# EAGLE board SPU_Rev_2.0 (EAGLE 9.6.2)
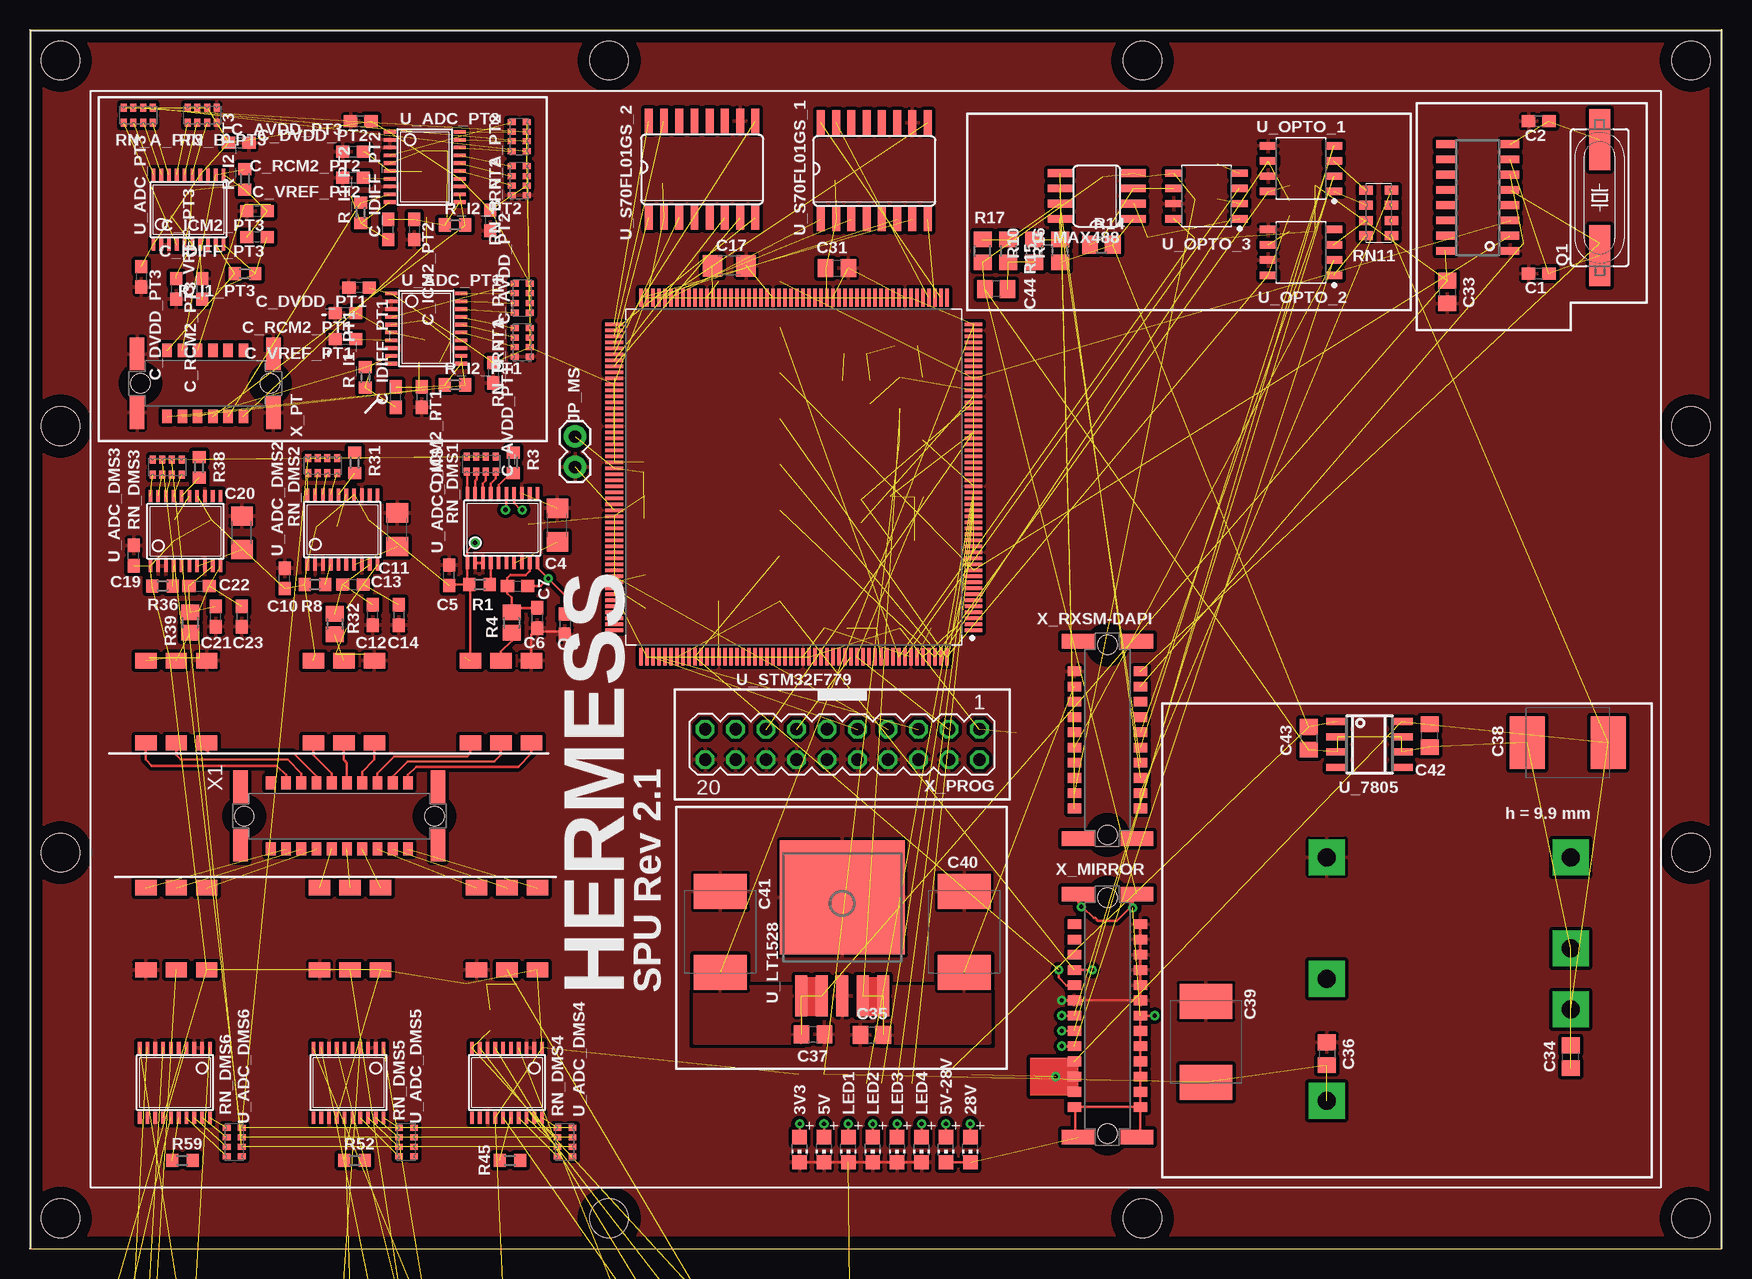
[diagram p9: board, top side]
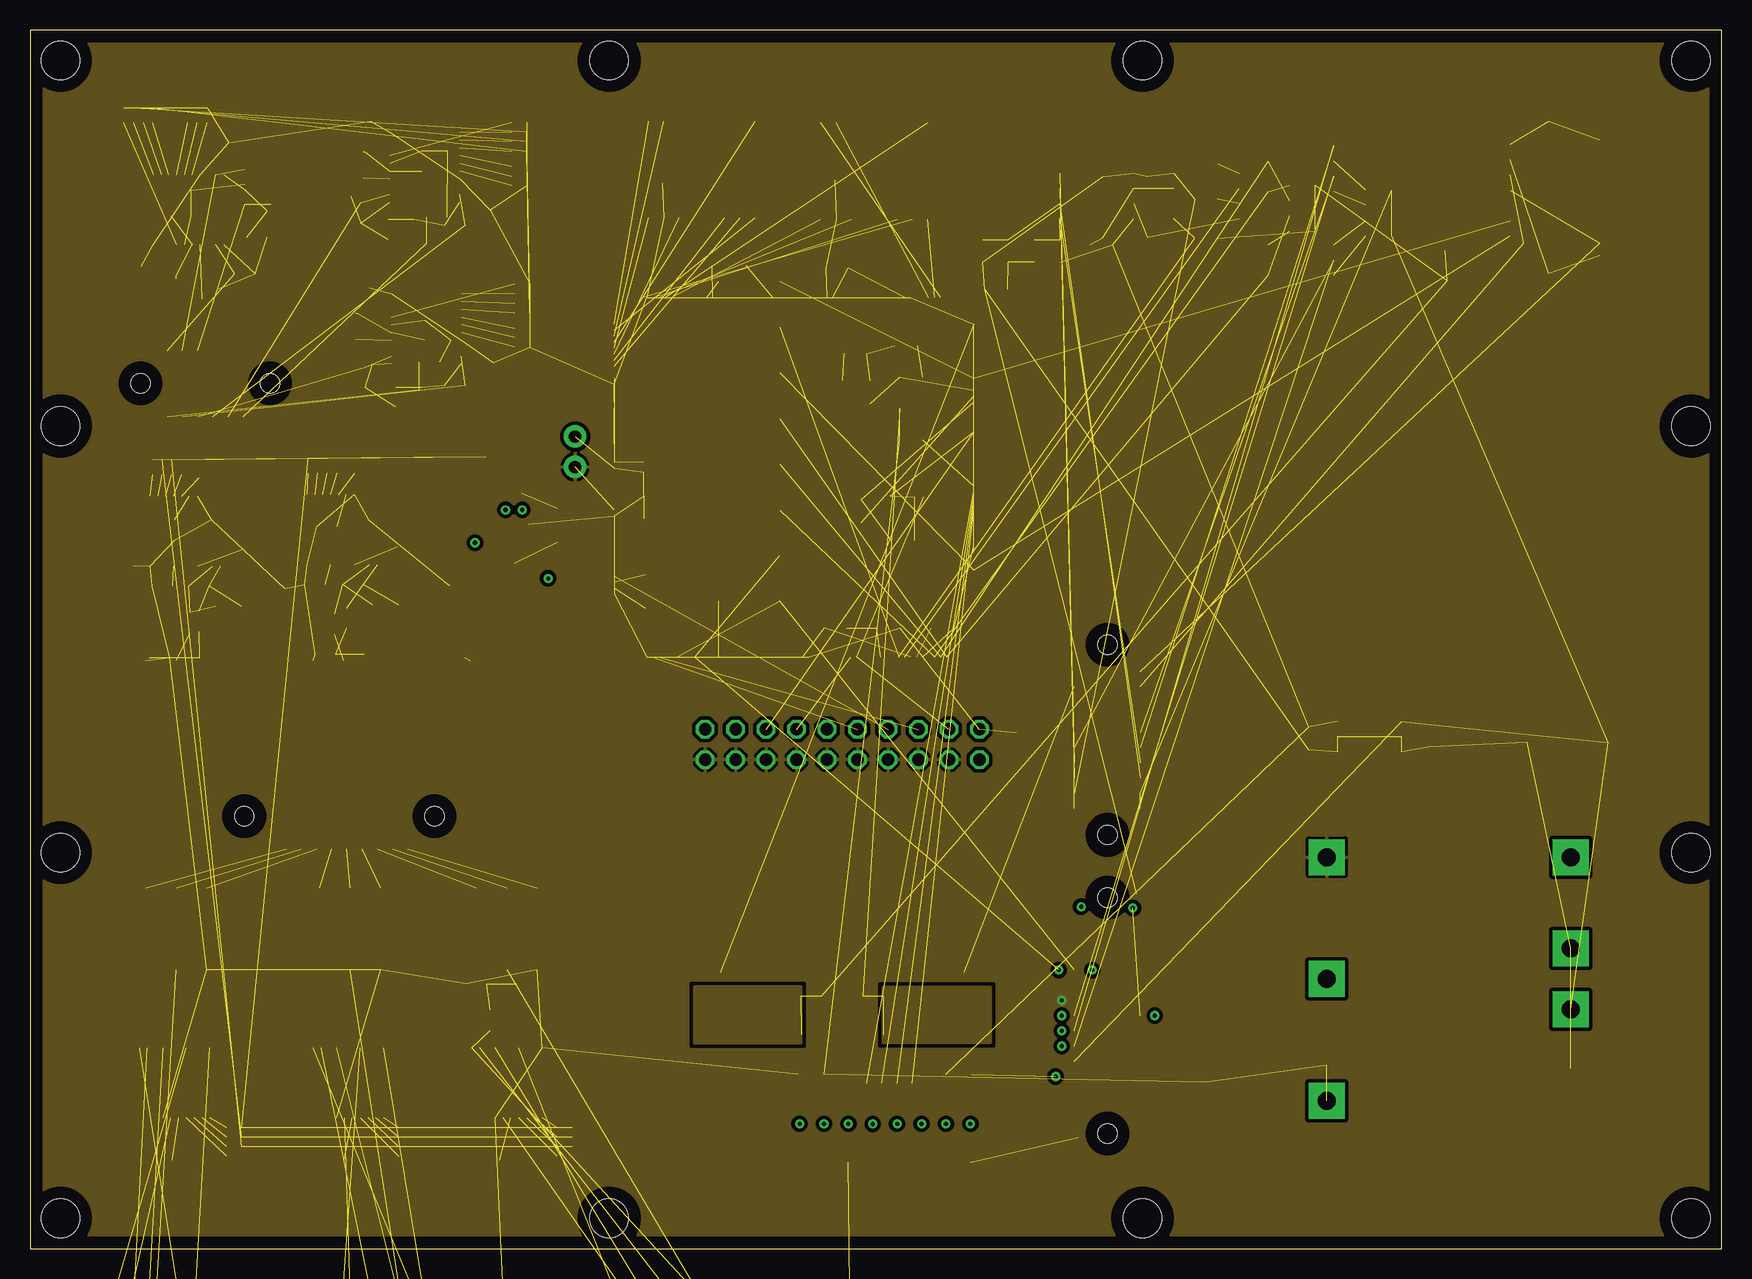
[diagram p10: board, inner layer Route2]
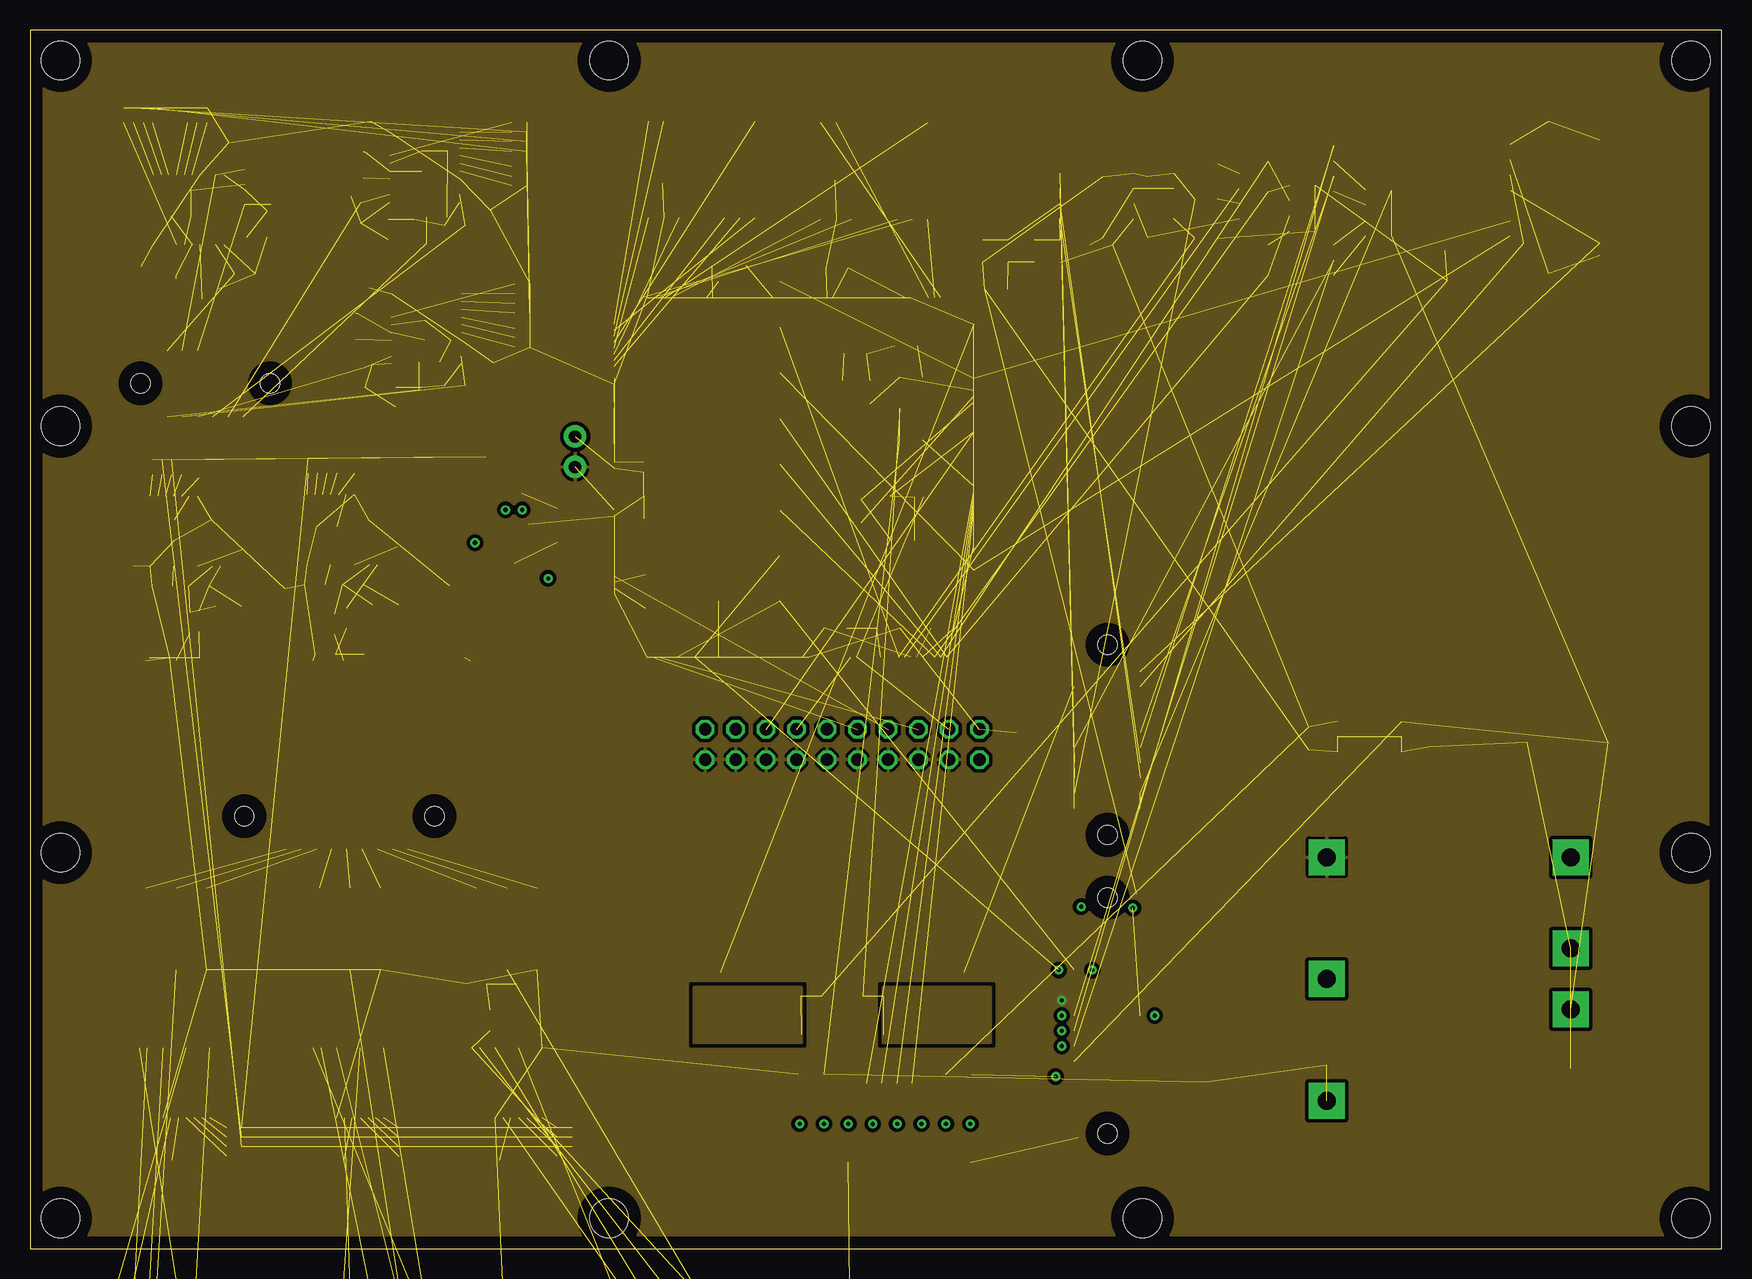
[diagram p11: board, inner layer Route15]
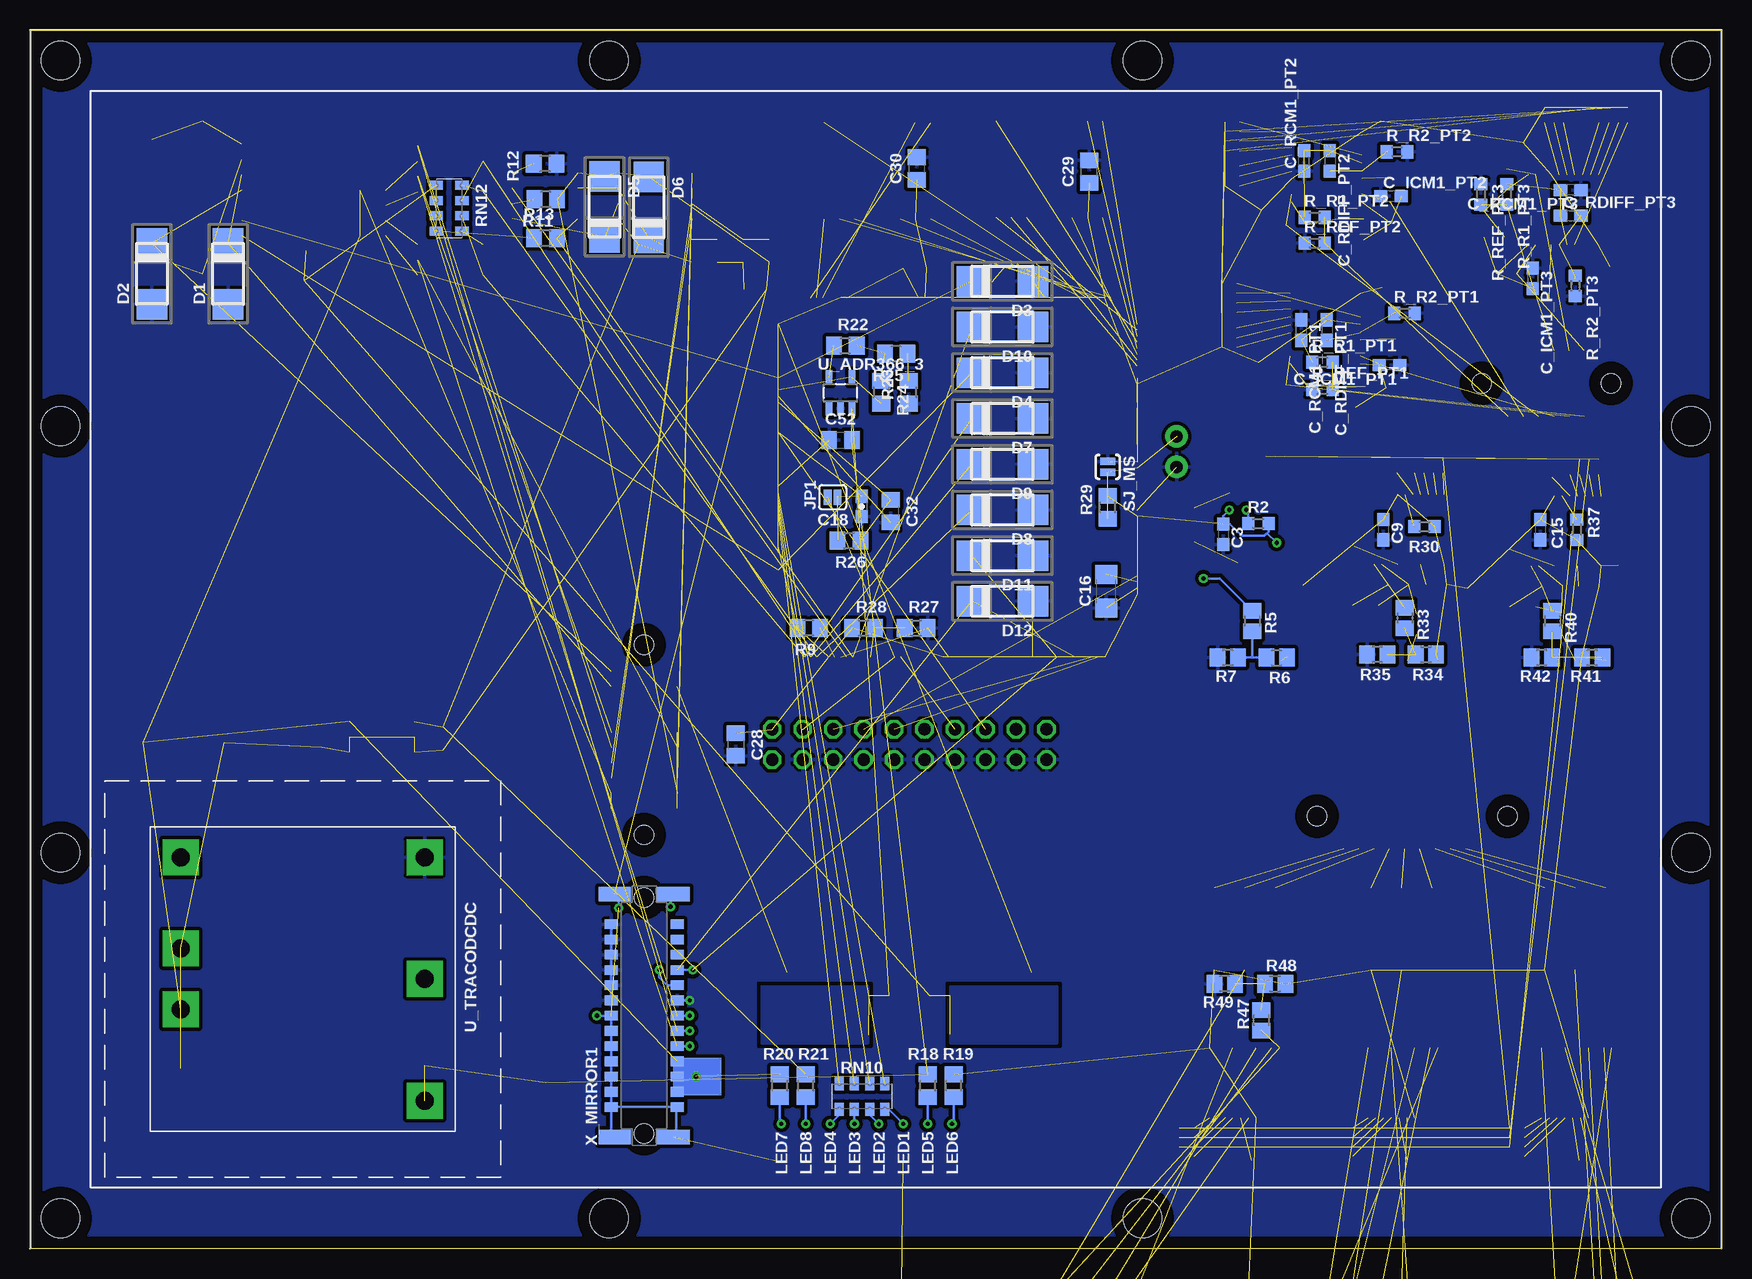
[diagram p12: board, bottom side, seen from below]

Size 140.97 x 101.6 mm. Coordinates in mm from the lower left corner, seen from the top.
Outline: 0,0 140.97,0 140.97,101.6 0,101.6 0,0
Copper layers (1+2+15+16): Top 0.035mm / dielectric 0.2mm / Route2 0.017mm / dielectric 0.2mm / Route15 0.017mm / dielectric 0.2mm / Bottom 0.035mm
Design rules "default *": minimum track width 8mil, minimum drill 0.35mm, track to track 9mil, track to pad 8mil, pad to pad 8mil, via to via 12mil, smd to smd 6mil, copper to edge 40mil, drill to drill 6mil, minimum pad ring 10mil, minimum via ring 8mil, stop-mask expansion 4mil, vias tented up to drill 0mil, thermal gap 10mil
Holes 3.2 mm at 2.54,99.06 2.54,2.54 138.43,2.54 138.43,99.06 48.26,99.06 92.71,99.06 48.26,2.54 92.71,2.54 2.54,68.58 2.54,33.02 138.43,33.02 138.43,68.58
tKeepout: area 0,0 to 141,101.6

## Footprints (pad centres in the part's own frame; a part is rotated, then mirrored left to right if it is on the bottom)
C0603 = smd 1.1 x 1: 1 -0.85,0; 2 0.85,0
C1206 = smd 1.6 x 1.8: 1 -1.4,0; 2 1.4,0
0603-CAP = smd 1.1 x 1: 1 -0.85,0; 2 0.85,0
C0805 = smd 1.3 x 1.5: 1 -0.95,0; 2 0.95,0
E/7260-38W = smd 2.95 x 4.4: + 3.375,0; - -3.375,0
DMELF = smd 2.54 x 2.54: A -2.54,0; C 2.54,0
SMT-JUMPER_2_NC_PASTE_SILK = smd 0.635 x 1.27: 1 -0.406,0; 2 0.406,0
1X02 = drill 1.016 pad 1.88: 1 0,0; 2 2.54,0
CHIP-LED0805 = smd 1.2 x 1.2: A 0,-1.05; C 0,1.05
SM49 = smd 5.08 x 1.778: 1 -4.826,0; 2 4.826,0
R0603 = smd 1 x 1.1: 1 -0.85,0; 2 0.85,0
R0805 = smd 1.3 x 1.5: 1 -0.85,0; 2 0.85,0
R0805' = smd 1.3 x 1.5: 1 -0.95,0; 2 0.95,0
EXBS8V = smd 0.75 x 1.1: 1 -1.905,-1.07; 2 -0.635,-1.07; 3 0.635,-1.07; 4 1.905,-1.07; 5 1.905,1.07; 6 0.635,1.07; 7 -0.635,1.07; 8 -1.905,1.07
0603-ARC = smd 0.5 x 0.65: 1 -1.2,-0.625; 2 -0.4,-0.625; 3 0.4,-0.625; 4 1.2,-0.625; 5 1.2,0.625; 6 0.4,0.625; 7 -0.4,0.625; 8 -1.2,0.625
SJ_2S-NO = smd 0.635 x 1.27: 1 -0.45,0; 2 0.45,0
COMMON_MODE_CHOKE = smd 1.27 x 1.78: P$1 0,5.08; P$2 6.86,5.08; P$3 0,2.54; P$4 6.86,2.54; P$5 0,0; P$6 6.86,0
SOIC8 = smd 0.6 x 1.8: 1 -1.905,-2.7; 2 -0.635,-2.7; 3 0.635,-2.7; 4 1.905,-2.7; 5 1.905,2.7; 6 0.635,2.7; 7 -0.635,2.7; 8 -1.905,2.7
TSSOP20 = smd 0.305 x 0.991: 1 -2.925,-2.918; 2 -2.275,-2.918; 3 -1.625,-2.918; 4 -0.975,-2.918; 5 -0.325,-2.918; 6 0.325,-2.918; 7 0.975,-2.918; 8 1.625,-2.918; 9 2.275,-2.918; 10 2.925,-2.918; 11 2.925,2.918; 12 2.275,2.918; 13 1.625,2.918; 14 0.975,2.918; 15 0.325,2.918; 16 -0.325,2.918; 17 -0.975,2.918; 18 -1.625,2.918; 19 -2.275,2.918; 20 -2.925,2.918
SOT23-5 = smd 0.55 x 1.2: 1 -0.95,-1.3; 2 0,-1.3; 3 0.95,-1.3; 4 0.95,1.3; 5 -0.95,1.3
SOIC16 = smd 0.635 x 1.524: 1 -4.445,-2.695; 2 -3.175,-2.695; 3 -1.905,-2.695; 4 -0.635,-2.695; 5 0.635,-2.695; 6 1.905,-2.695; 7 3.175,-2.695; 8 4.445,-2.695; 9 4.445,2.695; 10 3.175,2.695; 11 1.905,2.695; 12 0.635,2.695; 13 -0.635,2.695; 14 -1.905,2.695; 15 -3.175,2.695; 16 -4.445,2.695
Q5-DD = smd 1 x 3.4: 1 -3.4,-7.875; 2 -1.7,-7.875; 3 0,-7.875; 4 1.7,-7.875; 5 3.4,-7.875 | smd 10.414 x 9.525: 6 0,0.325
SO08 = smd 0.66 x 2.032: 1 -1.905,-3.073; 2 -0.635,-3.073; 3 0.635,-3.073; 4 1.905,-3.073; 5 1.905,3.073; 6 0.635,3.073; 7 -0.635,3.073; 8 -1.905,3.073
SOIC127P594X363-8N = smd 1.44 x 0.614: 1 -2.731,1.905; 2 -2.731,0.635; 3 -2.731,-0.635; 4 -2.731,-1.905; 5 2.731,-1.905; 6 2.731,-0.635; 7 2.731,0.635; 8 2.731,1.905
SO16 = smd 0.66 x 2.032: 1 -4.445,-3.073; 2 -3.175,-3.073; 3 -1.905,-3.073; 4 -0.635,-3.073; 5 0.635,-3.073; 6 1.905,-3.073; 7 3.175,-3.073; 8 4.445,-3.073; 9 4.445,4.978; 10 3.175,4.978; 11 1.905,4.978; 12 0.635,4.978; 13 -0.635,4.978; 14 -1.905,4.978; 15 -3.175,4.978; 16 -4.445,4.978
QFP50P3060X3060X385-208 = smd 1.469 x 0.28: 1 -14.971,12.75; 2 -14.971,12.25; 3 -14.971,11.75; 4 -14.971,11.25; 5 -14.971,10.75; 6 -14.971,10.25; 7 -14.971,9.75; 8 -14.971,9.25; 9 -14.971,8.75; 10 -14.971,8.25; 11 -14.971,7.75; 12 -14.971,7.25; 13 -14.971,6.75; 14 -14.971,6.25; 15 -14.971,5.75; 16 -14.971,5.25; 17 -14.971,4.75; 18 -14.971,4.25; 19 -14.971,3.75; 20 -14.971,3.25; 21 -14.971,2.75; 22 -14.971,2.25; 23 -14.971,1.75; 24 -14.971,1.25; 25 -14.971,0.75; 26 -14.971,0.25; 27 -14.971,-0.25; 28 -14.971,-0.75; 29 -14.971,-1.25; 30 -14.971,-1.75; 31 -14.971,-2.25; 32 -14.971,-2.75; 33 -14.971,-3.25; 34 -14.971,-3.75; 35 -14.971,-4.25; 36 -14.971,-4.75; 37 -14.971,-5.25; 38 -14.971,-5.75; 39 -14.971,-6.25; 40 -14.971,-6.75; 41 -14.971,-7.25; 42 -14.971,-7.75; 43 -14.971,-8.25; 44 -14.971,-8.75; 45 -14.971,-9.25; 46 -14.971,-9.75; 47 -14.971,-10.25; 48 -14.971,-10.75; 49 -14.971,-11.25; 50 -14.971,-11.75; 51 -14.971,-12.25; 52 -14.971,-12.75; 105 14.971,-12.75; 106 14.971,-12.25; 107 14.971,-11.75; 108 14.971,-11.25; 109 14.971,-10.75; 110 14.971,-10.25; 111 14.971,-9.75; 112 14.971,-9.25; 113 14.971,-8.75; 114 14.971,-8.25; 115 14.971,-7.75; 116 14.971,-7.25; 117 14.971,-6.75; 118 14.971,-6.25; 119 14.971,-5.75; 120 14.971,-5.25; 121 14.971,-4.75; 122 14.971,-4.25; 123 14.971,-3.75; 124 14.971,-3.25; 125 14.971,-2.75; 126 14.971,-2.25; 127 14.971,-1.75; 128 14.971,-1.25; 129 14.971,-0.75; 130 14.971,-0.25; 131 14.971,0.25; 132 14.971,0.75; 133 14.971,1.25; 134 14.971,1.75; 135 14.971,2.25; 136 14.971,2.75; 137 14.971,3.25; 138 14.971,3.75; 139 14.971,4.25; 140 14.971,4.75; 141 14.971,5.25; 142 14.971,5.75; 143 14.971,6.25; 144 14.971,6.75; 145 14.971,7.25; 146 14.971,7.75; 147 14.971,8.25; 148 14.971,8.75; 149 14.971,9.25; 150 14.971,9.75; 151 14.971,10.25; 152 14.971,10.75; 153 14.971,11.25; 154 14.971,11.75; 155 14.971,12.25; 156 14.971,12.75 | smd 0.28 x 1.469: 53 -12.75,-14.971; 54 -12.25,-14.971; 55 -11.75,-14.971; 56 -11.25,-14.971; 57 -10.75,-14.971; 58 -10.25,-14.971; 59 -9.75,-14.971; 60 -9.25,-14.971; 61 -8.75,-14.971; 62 -8.25,-14.971; 63 -7.75,-14.971; 64 -7.25,-14.971; 65 -6.75,-14.971; 66 -6.25,-14.971; 67 -5.75,-14.971; 68 -5.25,-14.971; 69 -4.75,-14.971; 70 -4.25,-14.971; 71 -3.75,-14.971; 72 -3.25,-14.971; 73 -2.75,-14.971; 74 -2.25,-14.971; 75 -1.75,-14.971; 76 -1.25,-14.971; 77 -0.75,-14.971; 78 -0.25,-14.971; 79 0.25,-14.971; 80 0.75,-14.971; 81 1.25,-14.971; 82 1.75,-14.971; 83 2.25,-14.971; 84 2.75,-14.971; 85 3.25,-14.971; 86 3.75,-14.971; 87 4.25,-14.971; 88 4.75,-14.971; 89 5.25,-14.971; 90 5.75,-14.971; 91 6.25,-14.971; 92 6.75,-14.971; 93 7.25,-14.971; 94 7.75,-14.971; 95 8.25,-14.971; 96 8.75,-14.971; 97 9.25,-14.971; 98 9.75,-14.971; 99 10.25,-14.971; 100 10.75,-14.971; 101 11.25,-14.971; 102 11.75,-14.971; 103 12.25,-14.971; 104 12.75,-14.971; 157 12.75,14.971; 158 12.25,14.971; 159 11.75,14.971; 160 11.25,14.971; 161 10.75,14.971; 162 10.25,14.971; 163 9.75,14.971; 164 9.25,14.971; 165 8.75,14.971; 166 8.25,14.971; 167 7.75,14.971; 168 7.25,14.971; 169 6.75,14.971; 170 6.25,14.971; 171 5.75,14.971; 172 5.25,14.971; 173 4.75,14.971; 174 4.25,14.971; 175 3.75,14.971; 176 3.25,14.971; 177 2.75,14.971; 178 2.25,14.971; 179 1.75,14.971; 180 1.25,14.971; 181 0.75,14.971; 182 0.25,14.971; 183 -0.25,14.971; 184 -0.75,14.971; 185 -1.25,14.971; 186 -1.75,14.971; 187 -2.25,14.971; 188 -2.75,14.971; 189 -3.25,14.971; 190 -3.75,14.971; 191 -4.25,14.971; 192 -4.75,14.971; 193 -5.25,14.971; 194 -5.75,14.971; 195 -6.25,14.971; 196 -6.75,14.971; 197 -7.25,14.971; 198 -7.75,14.971; 199 -8.25,14.971; 200 -8.75,14.971; 201 -9.25,14.971; 202 -9.75,14.971; 203 -10.25,14.971; 204 -10.75,14.971; 205 -11.25,14.971; 206 -11.75,14.971; 207 -12.25,14.971; 208 -12.75,14.971
THL_20WI_SERIES = drill 1.5 pad 3 square: 1 -2.54,10.16; 2 2.54,10.16; 3 -10.16,-10.16; 4 0,-10.16; 5 10.16,-10.16; 6 10.16,10.16
403-5X020-5X = smd 0.8 x 1.1: P$A1 5.715,-2.75; P$A2 4.445,-2.75; P$A3 3.175,-2.75; P$A4 1.905,-2.75; P$A5 0.635,-2.75; P$A6 -0.635,-2.75; P$A7 -1.905,-2.75; P$A8 -3.175,-2.75; P$A9 -4.445,-2.75; P$A10 -5.715,-2.75; P$B1 5.715,2.75; P$B2 4.445,2.75; P$B3 3.175,2.75; P$B4 1.905,2.75; P$B5 0.635,2.75; P$B6 -0.635,2.75; P$B7 -1.905,2.75; P$B8 -3.175,2.75; P$B9 -4.445,2.75; P$B10 -5.715,2.75 | smd 1.2 x 2.7: P$BL1 -8.225,2.45; P$BL2 8.225,2.45; P$BL3 -8.225,-2.45; P$BL4 8.225,-2.45 | hole 1.6: -7.925,0; 7.925,0
403-5X026-5X = smd 0.8 x 1.1: P$A1 7.62,-2.75; P$A2 6.35,-2.75; P$A3 5.08,-2.75; P$A4 3.81,-2.75; P$A5 2.54,-2.75; P$A6 1.27,-2.75; P$A7 0,-2.75; P$A8 -1.27,-2.75; P$A9 -2.54,-2.75; P$A10 -3.81,-2.75; P$A11 -5.08,-2.75; P$A12 -6.35,-2.75; P$A13 -7.62,-2.75; P$B1 7.62,2.75; P$B2 6.35,2.75; P$B3 5.08,2.75; P$B4 3.81,2.75; P$B5 2.54,2.75; P$B6 1.27,2.75; P$B7 0,2.75; P$B8 -1.27,2.75; P$B9 -2.54,2.75; P$B10 -3.81,2.75; P$B11 -5.08,2.75; P$B12 -6.35,2.75; P$B13 -7.62,2.75 | smd 1.2 x 2.7: P$BL1 -10.13,2.45; P$BL2 10.13,2.45; P$BL3 -10.13,-2.45; P$BL4 10.13,-2.45 | hole 1.6: -9.83,0; 9.83,0
MA10-2 = drill 1.016 octagon: 1 -11.43,-1.27; 2 -11.43,1.27; 3 -8.89,-1.27; 4 -8.89,1.27; 5 -6.35,-1.27; 6 -6.35,1.27; 7 -3.81,-1.27; 8 -3.81,1.27; 9 -1.27,-1.27; 10 -1.27,1.27; 11 1.27,-1.27; 12 1.27,1.27; 13 3.81,-1.27; 14 3.81,1.27; 15 6.35,-1.27; 16 6.35,1.27; 17 8.89,-1.27; 18 8.89,1.27; 19 11.43,-1.27; 20 11.43,1.27
403-5X012-5X = smd 0.8 x 1.1: P$A1 3.175,-2.75; P$A2 1.905,-2.75; P$A3 0.635,-2.75; P$A4 -0.635,-2.75; P$A5 -1.905,-2.75; P$A6 -3.175,-2.75; P$B1 3.175,2.75; P$B2 1.905,2.75; P$B3 0.635,2.75; P$B4 -0.635,2.75; P$B5 -1.905,2.75; P$B6 -3.175,2.75 | smd 1.2 x 2.7: P$BL1 -5.685,2.45; P$BL2 5.685,2.45; P$BL3 -5.685,-2.45; P$BL4 5.685,-2.45 | hole 1.6: -5.385,0; 5.385,0

## Placement (x,y rotation side)
C1  22p  [C0603]  125.73,81.28 180 top
C2  22p  [C0603]  125.73,93.98 180 top
C3  100n  [C0603]  41.53,59.56 270 bottom
C4  1u  [C1206]  43.94,60.33 90 top
C5  100n  [C0603]  34.93,56.13 90 top
C6  100n  [C0603]  42.29,52.58 90 top
C7  100n  [C0603]  40.64,55.24 0 top
C8  100n  [C0603]  44.58,52.07 270 top
C9  100n  [C0603]  28.19,59.94 270 bottom
C10  100n  [C0603]  21.21,55.88 90 top
C11  1u  [C1206]  30.61,59.94 90 top
C12  100n  [C0603]  28.58,52.83 90 top
C13  100n  [C0603]  26.92,55.37 0 top
C14  100n  [C0603]  30.73,52.83 270 top
C15  100n  [C0603]  15.11,59.94 270 bottom
C16  2.2u  [C1206]  51.28,54.81 90 bottom
C17  2.2u  [C1206]  58.27,81.94 180 top
C18  100n  [0603-CAP]  71.67,61.88 270 bottom
C19  100n  [C0603]  8.64,57.78 90 top
C20  1u  [C1206]  17.65,59.69 90 top
C21  100n  [C0603]  15.49,52.7 90 top
C22  100n  [C0603]  14.1,55.24 0 top
C23  100n  [C0603]  17.65,52.7 270 top
C24  100n  [C0603]  51.44,-14.35 90 top  (outside the outline)
C25  100n  [C0603]  55.25,-14.35 90 top  (outside the outline)
C26  1u  [C1206]  58.93,-15.11 90 top  (outside the outline)
C27  100n  [C0603]  62.1,-15.11 90 top  (outside the outline)
C28  100n  [C0805]  82.17,42.04 270 bottom
C29  100n  [C0805]  52.7,89.79 90 bottom
C30  100n  [C0805]  67.06,90.04 90 bottom
C31  100n  [C0805]  67.25,81.74 0 top
C32  100n  [C0805]  69.26,61.5 270 bottom
C33  100n  [C0805]  118.11,79.76 270 top
C34  100n  [C0805]  128.4,16 90 top
C35  100n  [C0805]  70.15,17.83 0 top
C36  100n  [C0805]  108.08,16.26 270 top
C37  100n  [C0805]  65.25,17.86 180 top
C38  10u  [E/7260-38W]  128.14,42.19 0 top
C39  10u  [E/7260-38W]  97.99,17.25 270 top
C40  10u  [E/7260-38W]  77.85,26.42 270 top
C41  10u  [E/7260-38W]  57.53,26.42 270 top
C42  100n  [C0805]  116.64,42.77 90 top
C43  100n  [C0805]  106.55,42.55 270 top
C44  ~0  [C0805]  80.52,80.01 180 top
C45  100n  [C0603]  65.02,-14.86 90 top  (outside the outline)
C46  100n  [C0603]  68.45,-14.61 90 top  (outside the outline)
C47  100n  [C0603]  37.08,-24.38 0 top  (outside the outline)
C48  100n  [C0603]  42.42,-24.38 0 top  (outside the outline)
C49  1u  [C1206]  34.42,-13.08 0 top  (outside the outline)
C50  100n  [C0603]  23.75,-29.72 0 top  (outside the outline)
C51  100n  [C0603]  29.08,-29.72 0 top  (outside the outline)
C52  10n  [C0805]  73.43,67.41 0 bottom
C53  100n  [C0603]  34.42,-29.72 0 top  (outside the outline)
C54  100n  [C0603]  13.46,-24.26 0 top  (outside the outline)
C55  100n  [C0603]  18.8,-24.26 0 top  (outside the outline)
C56  1u  [C1206]  10.79,-12.95 0 top  (outside the outline)
C57  100n  [C0603]  0.13,-29.59 0 top  (outside the outline)
C58  100n  [C0603]  5.46,-29.59 0 top  (outside the outline)
C59  100n  [C0603]  10.79,-29.59 0 top  (outside the outline)
C_AVDD_PT1  100n  [C0603]  38.61,73.03 270 top
C_AVDD_PT2  100n  [C0603]  38.35,85.72 270 top
C_AVDD_PT3  100n  [C0603]  17.4,92.2 0 top
C_DVDD_PT1  100n  [C0603]  27.43,80.14 180 top
C_DVDD_PT2  100n  [C0603]  27.56,93.98 180 top
C_DVDD_PT3  100n  [C0603]  9.27,81.03 270 top
C_ICM1_PT1  [C0603]  27.69,73.66 180 bottom
C_ICM1_PT2  [C0603]  27.56,87.76 0 bottom
C_ICM1_PT3  [C0603]  15.75,80.9 270 bottom
C_ICM2_PT1  [C0603]  32.64,70.99 270 top
C_ICM2_PT2  [C0603]  32,84.96 270 top
C_ICM2_PT3  [C0603]  18.92,86.49 180 top
C_IDIFF_PT1  [C0603]  30.48,70.99 90 top
C_IDIFF_PT2  [C0603]  29.84,84.96 90 top
C_IDIFF_PT3  [C0603]  18.92,84.33 180 top
C_RCM1_PT1  [C0603]  35.05,76.58 270 bottom
C_RCM1_PT2  [C0603]  34.8,90.68 90 bottom
C_RCM1_PT3  [C0603]  12.57,88.27 180 bottom
C_RCM2_PT1  [C0603]  26.29,77.98 180 top
C_RCM2_PT2  [C0603]  26.92,91.44 180 top
C_RCM2_PT3  [C0603]  12.19,80.01 270 top
C_RDIFF_PT1  [C0603]  32.89,76.58 270 bottom
C_RDIFF_PT2  [C0603]  32.64,90.68 270 bottom
C_RDIFF_PT3  [C0603]  12.57,86.11 0 bottom
C_VREF_PT1  1u  [C0603]  26.29,75.82 180 top
C_VREF_PT2  1u  [C0603]  26.92,89.28 180 top
C_VREF_PT3  1u  [C0603]  14.35,80.01 90 top
D1  6V  [DMELF]  124.46,81.28 90 bottom
D2  6V  [DMELF]  130.81,81.28 90 bottom
D3  3V6  [DMELF]  59.94,80.64 180 bottom
D4  3V6  [DMELF]  59.94,73.03 180 bottom
D5  6V  [DMELF]  93.09,86.87 270 bottom
D6  6V  [DMELF]  89.41,86.82 270 bottom
D7  3V6  [DMELF]  59.94,69.22 180 bottom
D8  3V6  [DMELF]  59.94,61.59 180 bottom
D9  3V6  [DMELF]  59.94,65.41 180 bottom
D10  3V6  [DMELF]  59.94,76.83 180 bottom
D11  3V6  [DMELF]  59.94,57.78 180 bottom
D12  3V6  [DMELF]  59.94,53.98 180 bottom
JP1  JUMPER-SMT_2_NC_PASTE_SILK  [SMT-JUMPER_2_NC_PASTE_SILK]  74.09,62.64 180 bottom
JP_MS  [1X02]  45.42,65.17 90 top
LED1  1V9  [CHIP-LED0805]  68.2,8.26 180 top
LED2  1V9  [CHIP-LED0805]  70.23,8.26 180 top
LED3  1V9  [CHIP-LED0805]  72.26,8.26 180 top
LED4  1V9  [CHIP-LED0805]  74.3,8.26 180 top
LED5  1V9  [CHIP-LED0805]  66.17,8.26 180 top
LED6  1V9  [CHIP-LED0805]  64.14,8.26 180 top
LED7  [CHIP-LED0805]  78.36,8.26 180 top
LED8  [CHIP-LED0805]  76.33,8.26 180 top
Q1  12MHz  [SM49]  130.81,87.63 90 top
R1  4k7  [R0603]  37.47,55.37 0 top
R2  4k7  [R0603]  38.61,60.45 0 bottom
R3  47  [R0603]  40.26,65.53 90 top
R4  40 1%  [R0805]  40.13,52.2 270 top
R5  40 1%  [R0805]  39.12,52.32 270 bottom
R6  1k 0.1%  [R0805]  37.08,49.28 0 bottom
R7  1k 0.1%  [R0805]  41.15,49.28 180 bottom
R8  4k7  [R0603]  23.75,55.37 0 top
R9  10k  [R0805']  76.07,51.75 180 bottom
R10  500  [R0805']  83.69,83.19 90 top
R11  3k  [R0805']  97.99,87.48 180 bottom
R12  2k  [R0805']  98.04,90.45 180 bottom
R13  4k7  [R0805']  98.02,84.23 180 bottom
R14  7k5  [R0805']  89.28,83.69 0 top
R15  500  [R0805']  81.53,83.19 270 top
R16  3k3  [R0805']  85.85,83.19 90 top
R17  3k3  [R0805']  79.38,83.19 90 top
R18  680  [R0805']  66.17,13.59 90 bottom
R19  330  [R0805']  64.01,13.59 90 bottom
R20  4k7  [R0805']  78.49,13.59 90 bottom
R21  470  [R0805']  76.33,13.59 90 bottom
R22  100k  [R0805']  73.03,75.29 0 bottom
R23  1k  [R0805']  67.74,71.4 90 bottom
R24  ?  [R0805']  70.03,71.4 270 bottom
R25  ?  [R0805']  68.79,74.6 180 bottom
R26  10k  [R0805']  72.73,59.04 0 bottom
R27  10k  [R0805']  67.12,51.75 0 bottom
R28  99M  [R0805']  71.51,51.75 0 bottom
R29  10k  [R0805']  51.17,61.8 90 bottom
R30  4k7  [R0603]  24.77,60.2 0 bottom
R31  47  [R0603]  27.05,65.53 90 top
R32  40 1%  [R0805]  25.4,52.07 270 top
R33  40 1%  [R0805]  26.42,52.58 270 bottom
R34  1k 0.1%  [R0805]  24.64,49.53 0 bottom
R35  1k 0.1%  [R0805]  28.7,49.53 180 bottom
R36  4k7  [R0603]  11.05,55.24 0 top
R37  4k7  [R0603]  12.06,59.94 270 bottom
R38  47  [R0603]  14.1,65.15 90 top
R39  40 1%  [R0805]  13.33,52.2 270 top
R40  40 1%  [R0805]  14.1,52.32 270 bottom
R41  1k 0.1%  [R0805]  10.79,49.28 180 bottom
R42  1k 0.1%  [R0805]  14.99,49.28 180 bottom
R43  4k7  [R0603]  50.93,-9.91 90 top  (outside the outline)
R44  4k7  [R0603]  54.74,-10.16 90 top  (outside the outline)
R45  47  [R0603]  40.01,7.37 0 top
R46  40 1%  [R0805]  59.18,-10.41 90 top  (outside the outline)
R47  40 1%  [R0805]  38.35,19.05 90 bottom
R48  1k 0.1%  [R0805]  37.21,22.1 0 bottom
R49  1k 0.1%  [R0805]  41.4,22.1 180 bottom
R50  4k7  [R0603]  23.75,-24.64 0 top  (outside the outline)
R51  4k7  [R0603]  28.19,-24.64 0 top  (outside the outline)
R52  47  [R0603]  27.05,7.37 0 top
R53  40 1%  [R0805]  32.39,-19.05 0 top  (outside the outline)
R54  40 1%  [R0805]  39.24,-19.05 0 top  (outside the outline)
R55  1k 0.1%  [R0805]  38.99,-12.83 0 top  (outside the outline)
R56  1k 0.1%  [R0805]  24.13,-19.05 0 top  (outside the outline)
R57  4k7  [R0603]  0.13,-24.51 0 top  (outside the outline)
R58  4k7  [R0603]  4.57,-24.51 0 top  (outside the outline)
R59  47  [R0603]  12.7,7.37 0 top
R60  40 1%  [R0805]  8.76,-18.92 0 top  (outside the outline)
R61  40 1%  [R0805]  15.62,-18.92 0 top  (outside the outline)
R62  1k 0.1%  [R0805]  15.37,-12.7 0 top  (outside the outline)
R63  1k 0.1%  [R0805]  0.51,-18.92 0 top  (outside the outline)
R_I1_PT1  [R0603]  27.94,72.64 90 top
R_I1_PT2  [R0603]  27.56,86.36 90 top
R_I1_PT3  [R0603]  17.91,81.28 180 top
R_I2_PT1  [R0603]  35.43,72.01 0 top
R_I2_PT2  [R0603]  35.43,85.34 0 top
R_I2_PT3  [R0603]  17.91,89.15 90 top
R_R1_PT1  [R0603]  33.27,73.91 0 bottom
R_R1_PT2  [R0603]  33.91,85.98 0 bottom
R_R1_PT3  [R0603]  17.91,87.88 270 bottom
R_R2_PT1  [R0603]  26.42,77.98 0 bottom
R_R2_PT2  [R0603]  27.05,91.44 0 bottom
R_R2_PT3  [R0603]  12.19,80.26 270 bottom
R_REF_PT1  [R0603]  33.27,71.63 0 bottom
R_REF_PT2  [R0603]  33.91,83.82 0 bottom
R_REF_PT3  [R0603]  20.07,87.88 270 bottom
RN10  330  [EXBS8V]  71.63,12.7 180 bottom
RN11  3k  [EXBS8V]  112.39,86.36 90 top
RN12  300  [EXBS8V]  106.05,86.74 270 bottom
RN_A_PT1  47  [0603-ARC]  41.02,79.25 270 top
RN_A_PT2  47  [0603-ARC]  40.77,92.71 270 top
RN_A_PT3  47  [0603-ARC]  9.02,94.49 0 top
RN_B_PT1  47  [0603-ARC]  41.02,75.56 270 top
RN_B_PT2  47  [0603-ARC]  40.77,89.03 270 top
RN_B_PT3  47  [0603-ARC]  14.35,94.49 0 top
RN_DMS1  47  [0603-ARC]  37.59,65.41 0 top
RN_DMS2  47  [0603-ARC]  24.38,65.28 0 top
RN_DMS3  47  [0603-ARC]  11.43,65.15 0 top
RN_DMS4  47  [0603-ARC]  44.58,8.89 270 top
RN_DMS5  47  [0603-ARC]  31.37,8.89 270 top
RN_DMS6  47  [0603-ARC]  17.02,8.89 270 top
SJ_MS  [SJ_2S-NO]  51.17,65.18 270 bottom
U$1  COMMON_MODE_CHOKE  [COMMON_MODE_CHOKE]  28.7,42.16 90 top
U$2  COMMON_MODE_CHOKE  [COMMON_MODE_CHOKE]  41.78,42.16 90 top
U$3  COMMON_MODE_CHOKE  [COMMON_MODE_CHOKE]  14.73,42.16 90 top
U$4  COMMON_MODE_CHOKE  [COMMON_MODE_CHOKE]  37.21,30.1 270 top
U$5  COMMON_MODE_CHOKE  [COMMON_MODE_CHOKE]  24.13,30.1 270 top
U$6  COMMON_MODE_CHOKE  [COMMON_MODE_CHOKE]  9.65,30.1 270 top
U_7805  LM78L05ACMX/NOPB  [SOIC8]  111.63,42.04 270 top
U_ADC_DMS1  ADS1147TSSOP20  [TSSOP20]  39.37,60.07 0 top
U_ADC_DMS2  ADS1147TSSOP20  [TSSOP20]  26.03,59.94 0 top
U_ADC_DMS3  ADS1147TSSOP20  [TSSOP20]  12.95,59.82 0 top
U_ADC_DMS4  ADS1147TSSOP20  [TSSOP20]  39.75,13.84 180 top
U_ADC_DMS5  ADS1147TSSOP20  [TSSOP20]  26.54,13.84 180 top
U_ADC_DMS6  ADS1147TSSOP20  [TSSOP20]  12.06,13.84 180 top
U_ADC_PT1  ADS1147TSSOP20  [TSSOP20]  33.02,76.71 270 top
U_ADC_PT2  ADS1147TSSOP20  [TSSOP20]  32.89,90.17 270 top
U_ADC_PT3  ADS1147TSSOP20  [TSSOP20]  13.21,86.61 0 top
U_ADR366_3  ADR366WAUJZ  [SOT23-5]  73.43,71.35 0 bottom
U_CH340G  CH340G  [SOIC16]  120.65,87.63 90 top
U_LT1528  LT1528  [Q5-DD]  67.69,28.96 0 top
U_MAX488  MAX488CSA  [SO08]  88.9,87.76 90 top
U_OPTO_1  MOCD207MSOIC-8  [SOIC127P594X363-8N]  105.92,90.04 180 top
U_OPTO_2  MOCD207MSOIC-8  [SOIC127P594X363-8N]  105.92,83.06 180 top
U_OPTO_3  MOCD207MSOIC-8  [SOIC127P594X363-8N]  98.04,87.76 180 top
U_S70FL01GS_1  S70FL01GS  [SO16]  70.36,88.9 0 top
U_S70FL01GS_2  S70FL01GS  [SO16]  56.01,89.03 0 top
U_STM32F779  STM32F77XXXLQFP208  [QFP50P3060X3060X385-208]  63.66,64.32 180 top
U_TRACODCDC  THN10-2411WIR  [THL_20WI_SERIES]  118.24,22.48 90 bottom
X1  403-5X020-5X  [403-5X020-5X]  25.78,36.07 0 top
X_MIRROR  403-5X026-5X  [403-5X026-5X]  89.79,19.43 270 top
X_MIRROR1  403-5X026-5X  [403-5X026-5X]  89.79,19.43 90 bottom
X_PROG  [MA10-2]  67.69,42.04 180 top
X_PT  403-5X012-5X  [403-5X012-5X]  14.6,72.14 180 top
X_RXSM-DAPI  403-5X020-5X  [403-5X020-5X]  89.79,42.42 270 top

## Tracks (layer width: path | path; a pad name or v marks a point on that pad's centre or on a via)
3V3  (via drill 0.35)  (94 unrouted)
  Top 0.203: U$2.P$2 36.7,55.28 R1.1 | R1.1 36.45,55.54 U_ADC_DMS1.1 36.45,58.21 v37.08,58.85 | R1.1 35.01,55.37 C5.1 | U_ADC_DMS1.14 40.34,62.14 40.89,61.59 v41.02,61.59
  Bottom 0.203: R2.2 37.76,59.78 37.91,59.63 | 37.91,59.63 38.1,59.44 40.01,59.44 40.98,60.41 C3.1 41.53,61.09 v41.02,61.59 | v37.08,58.85 37.86,59.63 37.91,59.63
  pour Top: 55.37,21.84 55.37,17.14 64.26,17.14 64.26,21.84
  pour Bottom: 64.26,21.84 64.26,17.14 55.37,17.14 55.37,21.84
  pour Route2: 55.37,17.14 64.26,17.14 64.26,21.84 55.37,21.84
  pour Route15: 55.37,21.84 64.26,21.84 64.26,17.14 55.37,17.14
3V3REF  (2 unrouted)
5V  (9 unrouted)
  pour Bottom: 80.01,21.84 80.01,17.14 71.12,17.14 71.12,21.84
  pour Top: 71.12,21.84 71.12,17.14 80.01,17.14 80.01,21.84
  pour Route15: 80.01,21.84 80.01,17.14 71.12,17.14 71.12,21.84
  pour Route2: 80.01,21.84 80.01,17.14 71.12,17.14 71.12,21.84
5V-28V  (5 unrouted)
28V  (via drill 0.35)  (12 unrouted)
  Top 0.203: v85.47,14.35 85.47,15.37 85.73,15.62 X_MIRROR1.P$A10 X_MIRROR1.P$A11 X_MIRROR1.P$A12
  Bottom 0.203: v85.47,14.35 X_MIRROR1.P$A11 | X_MIRROR1.P$A11 X_MIRROR1.P$A10 | X_MIRROR1.P$A11 X_MIRROR1.P$A12
28VGND  (via drill 0.35)  (21 unrouted)
  Top 0.203: v93.73,19.43 X_MIRROR1.P$B7 X_MIRROR1.P$B8 X_MIRROR1.P$B9 X_MIRROR1.P$B10 X_MIRROR1.P$B11 X_MIRROR1.P$B12 X_MIRROR1.P$B13 | X_MIRROR1.P$B13 X_MIRROR1.P$A13 87.12,11.73 87.12,9.52 X_MIRROR1.P$BL3 | X_MIRROR1.P$B13 92.54,9.6 X_MIRROR1.P$BL1 | 87.69,28.51 88.65,27.56 88.78,27.56 89,27.34 90.58,27.34 91.71,28.47 91.71,29.03 X_MIRROR1.P$BL2 91.9,29.22 v91.9,28.4 | 87.69,28.51 87.34,28.87 X_MIRROR1.P$BL4 | v87.59,28.51 87.69,28.51 | LED8.C LED7.C
  Bottom 0.203: X_MIRROR1.P$B13 X_MIRROR1.P$B12 X_MIRROR1.P$B11 X_MIRROR1.P$B10 X_MIRROR1.P$B9 X_MIRROR1.P$B8 X_MIRROR1.P$B7 v93.73,19.43 | X_MIRROR1.P$A13 87.12,11.81 | 87.12,11.81 X_MIRROR1.P$B13 | X_MIRROR1.P$BL3 87.12,9.52 87.12,11.81 | X_MIRROR1.P$BL1 92.54,9.6 X_MIRROR1.P$B13 | X_MIRROR1.P$BL4 87.59,29.3 v87.59,28.51 | v91.9,28.4 91.9,29.22 X_MIRROR1.P$BL2
DAPI_N  (2 unrouted)
DAPI_P  (2 unrouted)
DAPI_RX  (2 unrouted)
DAPI_TX  (2 unrouted)
DMS11
  Top 0.203: U$2.P$1 36.7,41.29 36.45,41.04 30.37,41.04 28.96,39.62 X1.P$B3
DMS12
  Top 0.203: U$2.P$3 39.24,41.15 38.7,40.6 31.46,40.6 30.23,39.37 X1.P$B2
DMS13
  Top 0.203: X1.P$B1 31.5,39.5 32.17,40.17 40.68,40.17 41.78,41.27 U$2.P$5
DMS21
  Top 0.203: U$1.P$1 23.62,41.15 25.15,39.62 X1.P$B6
DMS22
  Top 0.203: U$1.P$3 26.16,40.77 26.42,40.51 X1.P$B5
DMS23
  Top 0.203: X1.P$B4 27.69,39.75 28.7,40.77 U$1.P$5
DMS31
  Top 0.203: X1.P$B9 21.34,39.5 20.57,40.26 10.16,40.26 9.65,40.77 U$3.P$1
DMS32
  Top 0.203: U$3.P$3 12.19,41.15 12.57,40.77 21.46,40.77 22.61,39.62 X1.P$B8
DMS33
  Top 0.203: X1.P$B7 23.88,39.37 21.97,41.27 14.99,41.27 14.73,41.53 U$3.P$5
DMS41  (1 unrouted)
DMS42  (1 unrouted)
DMS43  (1 unrouted)
DMS51  (1 unrouted)
DMS52  (1 unrouted)
DMS53  (1 unrouted)
DMS61  (1 unrouted)
DMS62  (1 unrouted)
DMS63  (1 unrouted)
DMS_DIN  (5 unrouted)
DMS_DOUT  (5 unrouted)
DMS_SCLK  (5 unrouted)
EXP_IN  (2 unrouted)
EXP_IN_N  (3 unrouted)
EXP_IN_OPT  (3 unrouted)
EXP_IN_P  (3 unrouted)
EXP_OUT  (3 unrouted)
EXP_OUT_N  (1 unrouted)
EXP_OUT_OPT  (1 unrouted)
EXP_OUT_P  (1 unrouted)
FL_1_CS1  (1 unrouted)
FL_1_CS2  (1 unrouted)
FL_1_HLD  (1 unrouted)
FL_1_RES  (1 unrouted)
FL_1_WP  (1 unrouted)
FL_2_CS1  (1 unrouted)
FL_2_CS2  (1 unrouted)
FL_2_HLD  (1 unrouted)
FL_2_RES  (1 unrouted)
FL_2_WP  (1 unrouted)
GND  (via drill 0.35)  (34 unrouted)
  Top 0.203: v85.98,20.7 X_MIRROR1.P$A6 X_MIRROR1.P$B6 X_MIRROR1.P$B5 X_MIRROR1.P$B4 X_MIRROR1.P$B3 X_MIRROR1.P$B2 X_MIRROR1.P$B1 | LED6.C LED5.C LED1.C LED2.C LED3.C LED4.C | C8.2 44.32,51.47 42.55,51.47 C6.1 41.78,51.22 U$2.P$6 | U_ADC_DMS1.3 U_ADC_DMS1.2
  Bottom 0.203: X_MIRROR1.P$A6 v85.98,20.7 | X_MIRROR1.P$B6 X_MIRROR1.P$B5 X_MIRROR1.P$B3 | X_MIRROR1.P$B3 X_MIRROR1.P$B2 X_MIRROR1.P$B1 | X_MIRROR1.P$B4 X_MIRROR1.P$B3
  pour Top (isolate 0.305, rank 2): 0,101.6 0,0 140.97,0 140.97,101.6
  pour Bottom (isolate 0.305, rank 2): 140.97,101.6 140.97,0 0,0 0,101.6
  pour Route2 (isolate 0.305, rank 2): 140.97,101.6 140.97,0 0,0 0,101.6
  pour Route15 (isolate 0.305, rank 2): 140.97,101.6 140.97,0 0,0 0,101.6
INTERSPU_RX  (via drill 0.35)  (2 unrouted)
  Top 0.203: X_MIRROR.P$A9 86.36,21.97 85.73,22.61 v85.73,23.24
  Bottom 0.203: v85.73,23.24 X_MIRROR1.P$A4
INTERSPU_TX  (via drill 0.35)  (2 unrouted)
  Top 0.203: v88.52,23.24 X_MIRROR.P$A10
  Bottom 0.203: X_MIRROR1.P$A5 87.88,21.97 88.52,22.61 v88.52,23.24
LED_1  (1 unrouted)
LED_2  (1 unrouted)
LED_3  (1 unrouted)
LED_4  (1 unrouted)
LO  (via drill 0.35)  (2 unrouted)
  Top 0.203: X_MIRROR1.P$A9 v85.98,16.89
  Bottom 0.203: v85.98,16.89 X_MIRROR1.P$A9
LO_OPT  (3 unrouted)
MS_SEL  (3 unrouted)
N$1  (2 unrouted)
N$2  (via drill 0.35)
  Top 0.203: U_ADC_DMS1.15 39.7,61.67 v39.62,61.59
  Bottom 0.203: v39.62,61.59 39.46,61.43 R2.1
N$3  (2 unrouted)
N$4  (3 unrouted)
N$5  (3 unrouted)
N$6  (3 unrouted)
N$7  (3 unrouted)
N$8  (1 unrouted)
N$9  (3 unrouted)
N$10
  Top 0.203: RN_DMS1.1 36.45,64.73 U_ADC_DMS1.20
N$11  (3 unrouted)
N$12  (2 unrouted)
N$13  (3 unrouted)
N$14  (3 unrouted)
N$15  (3 unrouted)
N$16  (1 unrouted)
N$20  (1 unrouted)
N$21  (1 unrouted)
N$22  (3 unrouted)
N$23  (1 unrouted)
N$24  (1 unrouted)
N$25  (1 unrouted)
N$26  (1 unrouted)
N$27  (1 unrouted)
N$28  (1 unrouted)
N$29  (1 unrouted)
N$30  (via drill 0.35)
  Top 0.203: LED1.A v68.2,10.41
  Bottom 0.203: v68.2,10.41 69.42,11.63 RN10.8
N$31  (via drill 0.35)
  Top 0.203: LED2.A v70.23,10.4
  Bottom 0.203: v70.23,10.4 70.99,11.16 RN10.7
N$32  (via drill 0.35)
  Top 0.203: LED3.A v72.26,10.41
  Bottom 0.203: v72.26,10.41 RN10.6
N$33  (via drill 0.35)
  Top 0.203: LED4.A v74.3,10.41
  Bottom 0.203: v74.3,10.41 73.53,11.18 RN10.5
N$34  (1 unrouted)
N$35  (1 unrouted)
N$36  (1 unrouted)
N$37  (1 unrouted)
N$38  (1 unrouted)
N$39  (1 unrouted)
N$40  (3 unrouted)
N$41  (3 unrouted)
N$42  (1 unrouted)
N$43  (1 unrouted)
N$44  (1 unrouted)
N$45  (1 unrouted)
N$46  (1 unrouted)
N$47  (1 unrouted)
N$49  (1 unrouted)
N$50  (2 unrouted)
N$51  (via drill 0.35)
  Top 0.203: LED5.A v66.17,10.41
  Bottom 0.203: v66.17,10.41 R18.1
N$52  (via drill 0.35)
  Top 0.203: LED6.A v64.14,10.41
  Bottom 0.203: v64.14,10.41 64.01,10.54 R19.1
N$53  (3 unrouted)
N$54  (3 unrouted)
N$55  (via drill 0.35)
  Top 0.203: LED7.A v78.36,10.41
  Bottom 0.203: v78.36,10.41 78.49,10.54 R20.1
N$56  (via drill 0.35)
  Top 0.203: LED8.A v76.33,10.41
  Bottom 0.203: v76.33,10.41 R21.1
N$57  (1 unrouted)
N$58  (1 unrouted)
N$59  (1 unrouted)
N$60  (1 unrouted)
N$61  (1 unrouted)
N$62  (1 unrouted)
N$63  (1 unrouted)
N$64  (1 unrouted)
N$65  (1 unrouted)
N$66  (1 unrouted)
N$67  (1 unrouted)
N$68  (1 unrouted)
N$69  (2 unrouted)
N$70  (1 unrouted)
N$71  (2 unrouted)
N$72  (1 unrouted)
N$73
  Top 0.203: U_ADC_DMS1.4 38.4,55.45 R1.2
N$74
  Top 0.203: U_ADC_DMS1.19 37.09,64.02 37.21,64.14 37.21,64.76 RN_DMS1.2
N$75
  Top 0.203: U_ADC_DMS1.18 37.75,63.78 37.99,64.03 RN_DMS1.3
N$76
  Top 0.203: U_ADC_DMS1.17 38.4,63.8 38.79,64.19 RN_DMS1.4
N$77
  Top 0.203: U_ADC_DMS1.16 39.05,63.68 40.04,64.68 R3.1
N$78  (1 unrouted)
N$79  (1 unrouted)
N$80
  Top 0.203: C6.2 40.51,53.43 R4.1 40.13,54.27 39.79,54.61 C7.1 39.79,55.92 40.03,56.16 41.3,56.16 41.65,56.5 U_ADC_DMS1.9
N$81  (via drill 0.35)
  Top 0.203: v43.18,55.88 42.3,56.77 U_ADC_DMS1.10 | v43.18,55.88 44.58,54.48 C8.1 | v43.18,55.88 42.55,55.24 C7.2
  Bottom 0.203: R5.1 41.82,55.88 v43.18,55.88
N$82
  Bottom 0.203: R6.1 39.12,49.28 | 39.12,49.28 R7.1 | R5.2 39.12,49.28
N$83  (1 unrouted)
N$84
  Top 0.203: U$2.P$4 39.24,49.78 40.13,50.67 R4.2
N$85  (1 unrouted)
N$86  (1 unrouted)
N$87  (1 unrouted)
N$88  (1 unrouted)
N$89  (1 unrouted)
N$90  (3 unrouted)
N$91  (3 unrouted)
N$92  (2 unrouted)
N$93  (1 unrouted)
N$94  (1 unrouted)
N$95  (1 unrouted)
N$96  (1 unrouted)
N$97  (1 unrouted)
N$98  (1 unrouted)
N$99  (1 unrouted)
N$100  (1 unrouted)
N$101  (1 unrouted)
N$102  (3 unrouted)
N$103  (3 unrouted)
N$104  (2 unrouted)
N$105  (1 unrouted)
N$106  (1 unrouted)
N$107  (1 unrouted)
N$108  (1 unrouted)
N$109  (1 unrouted)
N$110  (1 unrouted)
N$111  (1 unrouted)
N$112  (1 unrouted)
N$113  (1 unrouted)
N$114  (3 unrouted)
N$115  (3 unrouted)
N$116  (2 unrouted)
N$117  (1 unrouted)
N$118  (1 unrouted)
N$119  (1 unrouted)
N$120  (1 unrouted)
N$121  (1 unrouted)
N$122  (1 unrouted)
N$123  (1 unrouted)
N$124  (1 unrouted)
N$125  (1 unrouted)
N$127  (2 unrouted)
N$128  (3 unrouted)
N$129  (3 unrouted)
N$130  (2 unrouted)
N$131  (1 unrouted)
N$132  (1 unrouted)
N$133  (1 unrouted)
N$134  (1 unrouted)
N$135  (1 unrouted)
N$136  (1 unrouted)
N$137  (1 unrouted)
N$138  (1 unrouted)
N$139  (1 unrouted)
N$141  (2 unrouted)
NRST  (4 unrouted)
PRD_ON  (1 unrouted)
PT11  (2 unrouted)
PT12  (2 unrouted)
PT13  (2 unrouted)
PT21  (2 unrouted)
PT22  (2 unrouted)
PT23  (2 unrouted)
PT31  (2 unrouted)
PT32  (2 unrouted)
PT33  (2 unrouted)
PT_DIN  (2 unrouted)
PT_DOUT  (2 unrouted)
PT_SCLK  (2 unrouted)
SODS  (via drill 0.35)  (2 unrouted)
  Top 0.203: X_MIRROR1.P$A7 v85.98,19.43
  Bottom 0.203: v85.98,19.43 X_MIRROR1.P$A7
SODS_OPT  (3 unrouted)
SOE  (via drill 0.35)  (2 unrouted)
  Top 0.203: v85.98,18.16 X_MIRROR1.P$A8
  Bottom 0.203: X_MIRROR1.P$A8 v85.98,18.16
SOE_OPT  (3 unrouted)
SPI2_MISO  (1 unrouted)
SPI2_MOSI  (1 unrouted)
SPI2_SCK  (1 unrouted)
SPI6_MISO  (1 unrouted)
SPI6_MOSI  (1 unrouted)
SPI6_SCK  (1 unrouted)
TCK  (1 unrouted)
TDI  (1 unrouted)
TDO  (1 unrouted)
TMS  (1 unrouted)
TRST  (2 unrouted)
(copper drawn outside any net)
  shapes: Bottom area x1, Top area x3

## Text on the board
tNames: h = 9.9 mm | HERMESS | SPU Rev 2.1 | 3V3 | 5V | LED1 | LED2 | LED3 | LED4 | 5V-28V | 28V